# EAGLE design CrashButtonESP8266test (EAGLE 6.6.0)
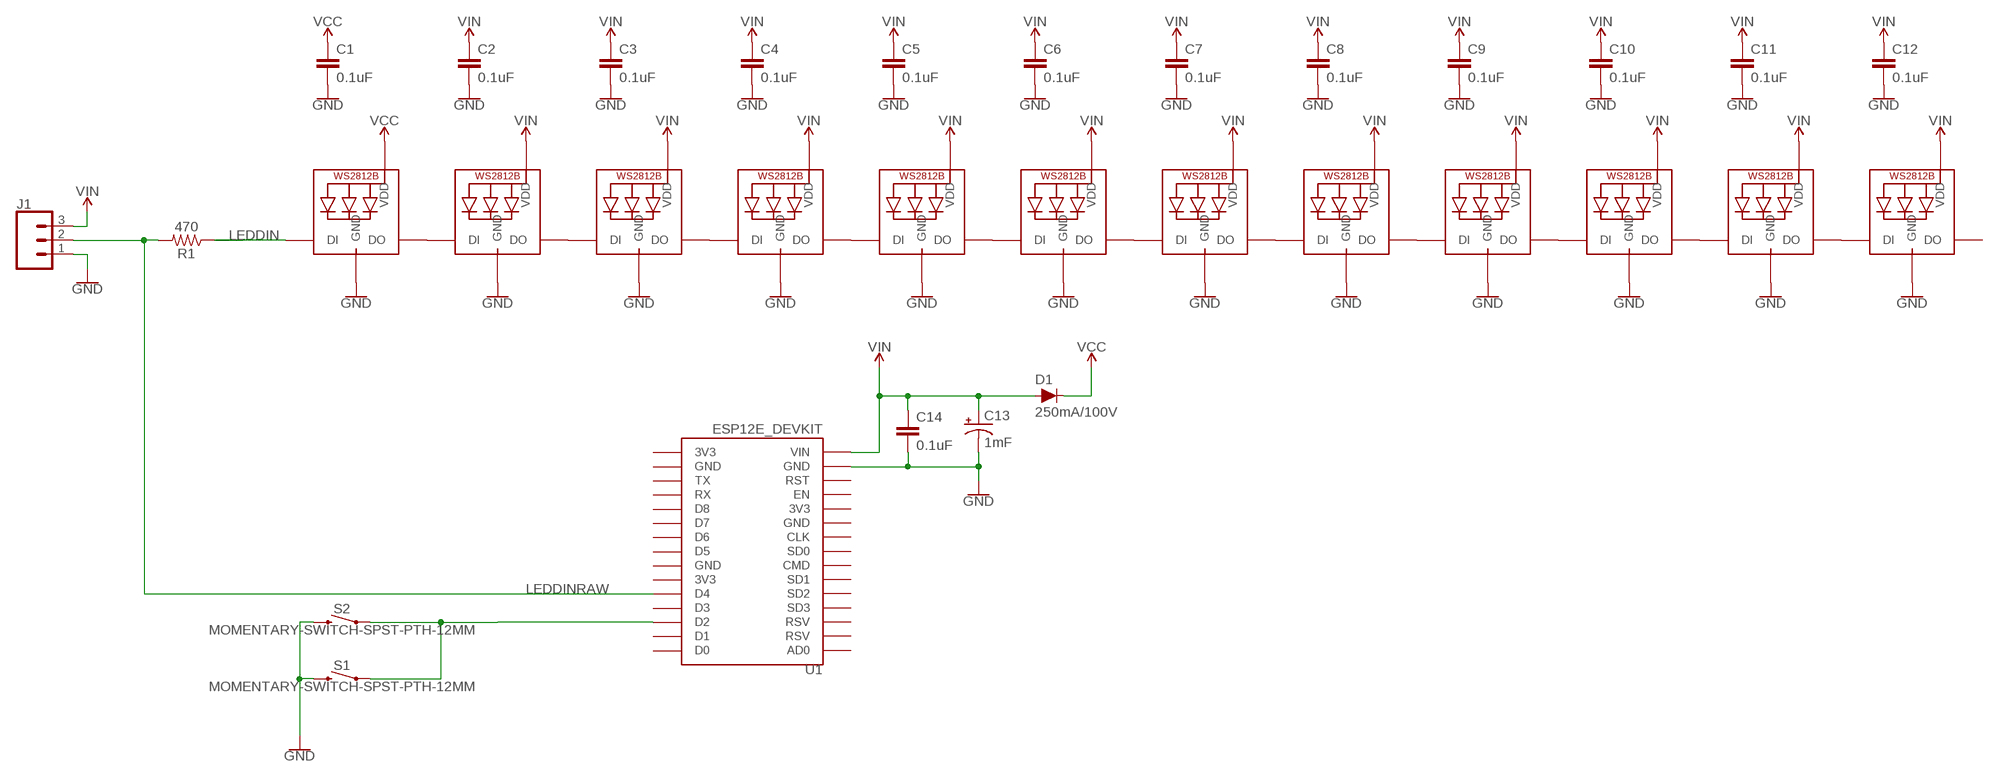
[diagram p0: schematic, sheet 1]

## Parts
C1  0.1uF  0.1UF-0603-25V-(+80/-20%)  [0603]
C2  0.1uF  0.1UF-0603-25V-(+80/-20%)  [0603]
C3  0.1uF  0.1UF-0603-25V-(+80/-20%)  [0603]
C4  0.1uF  0.1UF-0603-25V-(+80/-20%)  [0603]
C5  0.1uF  0.1UF-0603-25V-(+80/-20%)  [0603]
C6  0.1uF  0.1UF-0603-25V-(+80/-20%)  [0603]
C7  0.1uF  0.1UF-0603-25V-(+80/-20%)  [0603]
C8  0.1uF  0.1UF-0603-25V-(+80/-20%)  [0603]
C9  0.1uF  0.1UF-0603-25V-(+80/-20%)  [0603]
C10  0.1uF  0.1UF-0603-25V-(+80/-20%)  [0603]
C11  0.1uF  0.1UF-0603-25V-(+80/-20%)  [0603]
C12  0.1uF  0.1UF-0603-25V-(+80/-20%)  [0603]
C13  1mF  1000UF-RADIAL-5MM-25V-20%  [CPOL-RADIAL-5MM-10MM]
C14  0.1uF  0.1UF-0603-25V-(+80/-20%)  [0603]
D1  250mA/100V  DIODE-BAS16J  [SOD-323]
J1  CONN_03  [1X03]
LED1  WS2812B5050  [WS2812B]
LED2  WS2812B5050  [WS2812B]
LED3  WS2812B5050  [WS2812B]
LED4  WS2812B5050  [WS2812B]
LED5  WS2812B5050  [WS2812B]
LED6  WS2812B5050  [WS2812B]
LED7  WS2812B5050  [WS2812B]
LED8  WS2812B5050  [WS2812B]
LED9  WS2812B5050  [WS2812B]
LED10  WS2812B5050  [WS2812B]
LED11  WS2812B5050  [WS2812B]
LED12  WS2812B5050  [WS2812B]
R1  470  470OHM-0603-1/10W-1%  [0603]
S1  MOMENTARY-SWITCH-SPST-PTH-12MM  [TACTILE_SWITCH_PTH_12MM]
S2  MOMENTARY-SWITCH-SPST-PTH-12MM  [TACTILE_SWITCH_PTH_12MM]
U1  ESP12E_DEVKIT  [ESP12E_DEVKIT]

## Nets
GND: C1.2 C2.2 C3.2 C4.2 C5.2 C6.2 C7.2 C8.2 C9.2 C10.2 C11.2 C12.2 C13.- C14.2 J1.1 LED1.3-GND(GND) LED2.3-GND(GND) LED3.3-GND(GND) LED4.3-GND(GND) LED5.3-GND(GND) LED6.3-GND(GND) LED7.3-GND(GND) LED8.3-GND(GND) LED9.3-GND(GND) LED10.3-GND(GND) LED11.3-GND(GND) LED12.3-GND(GND) S1.3 S2.3 U1.GND@1(GND)
LEDDIN: LED1.4-DIN(DI) R1.1
LEDDINRAW: J1.2 R1.2 U1.D4
N$1: LED1.2-DOUT(DO) LED2.4-DIN(DI)
N$2: LED2.2-DOUT(DO) LED3.4-DIN(DI)
N$3: LED3.2-DOUT(DO) LED4.4-DIN(DI)
N$4: LED4.2-DOUT(DO) LED5.4-DIN(DI)
N$5: LED5.2-DOUT(DO) LED6.4-DIN(DI)
N$6: LED6.2-DOUT(DO) LED7.4-DIN(DI)
N$7: LED8.2-DOUT(DO) LED9.4-DIN(DI)
N$8: LED9.2-DOUT(DO) LED10.4-DIN(DI)
N$9: LED10.2-DOUT(DO) LED11.4-DIN(DI)
N$10: S1.1 S2.1 U1.D2
N$12: LED7.2-DOUT(DO) LED8.4-DIN(DI)
N$13: LED11.2-DOUT(DO) LED12.4-DIN(DI)
VCC: C1.1 D1.C LED1.1-VDD(VDD)
VIN: C2.1 C3.1 C4.1 C5.1 C6.1 C7.1 C8.1 C9.1 C10.1 C11.1 C12.1 C13.+ C14.1 D1.A J1.3 LED2.1-VDD(VDD) LED3.1-VDD(VDD) LED4.1-VDD(VDD) LED5.1-VDD(VDD) LED6.1-VDD(VDD) LED7.1-VDD(VDD) LED8.1-VDD(VDD) LED9.1-VDD(VDD) LED10.1-VDD(VDD) LED11.1-VDD(VDD) LED12.1-VDD(VDD) U1.VIN
Unconnected: LED12.2-DOUT(DO) U1.3V3@0(3V3) U1.3V3@1(3V3) U1.3V3@2(3V3) U1.AD0 U1.CLK U1.CMD U1.D0 U1.D1 U1.D3 U1.D5 U1.D6 U1.D7 U1.D8 U1.EN U1.GND@0(GND) U1.GND@2(GND) U1.GND@3(GND) U1.RST U1.RSV@0(RSV) U1.RSV@1(RSV) U1.RX U1.SD0 U1.SD1 U1.SD2 U1.SD3 U1.TX

## Library data of the parts
C1-C12 C14 = SparkFun-Capacitors:0.1UF: 0.1µF ceramic capacitors A capacitor is a passive two-terminal electrical component used to store electrical energy temporarily in an electric field.; PROD_ID: CAP-00810
C13 = SparkFun-Capacitors:1000UF: 1,000µF/1mF ceramic capacitors A capacitor is a passive two-terminal electrical component used to store electrical energy temporarily in an electric field. CAP-08070; PROD_ID: CAP-09538
D1 = SparkFun-DiscreteSemi:DIODE: Diode These are standard reverse protection diodes and small signal diodes. SparkFun Products: SparkFun SparkPunk Sound Kit <https://www.sparkfun.com/products/11177> SparkFun ESP8266 Thing <https://www.sparkfun.com/products/13231>; PROD_ID: DIO-09646
J1 = SparkFun-Connectors:CONN_03: Multi connection point. Often used as Generic Header-pin footprint for 0.1 inch spaced/style header connections On any of the 0.1 inch spaced packages, you can populate with these: Break Away Headers - Straight <https://www.sparkfun.com/products/116> (PRT-00116) Break Away Male Headers - Right Angle <https://www.sparkfun.com/products/553> (PRT-00553) Female Headers <https://www.sparkfun.com/products/115> (PRT-00115) Break Away Headers - Machine Pin <https://www.sparkfun.com/products/117> (PRT-00117) Break Away Female Headers - Swiss Machine Pin <https://www.sparkfun.com/products/743> (PRT-00743) Stackable Header - 3 Pin (Female, 0.1") <https://www.sparkfun.com/products/13875> (PRT-13875) For SCREWTERMINALS and SPRING TERMINALS visit here: Screw Terimnals on SparkFun.com <https://www.sparkfun.com/search/results?term=Screw+Terminals> (5mm/3.5mm/2.54mm spacing) This device is also useful as a general connection point to wire up your design to another part of your project. Our various solder wires solder well into these plated through hole pads. Hook-Up Wire - Assortment (Stranded, 22 AWG) <https://www.sparkfun.com/products/11375> (PRT-11375) Hook-Up Wire - Assortment (Solid Core, 22 AWG) <https://www.sparkfun.com/products/11367> (PRT-11367) View the entire wire category on our website here <https://www.sparkfun.com/categories/141> Special notes: Molex polarized connector foot print use with SKU : PRT-08232 with associated crimp pins and housings.
LED1-LED12 = adafruit:WS2812B
R1 = SparkFun-Resistors:470OHM: 470Ω resistor A resistor is a passive two-terminal electrical component that implements electrical resistance as a circuit element. Resistors act to reduce current flow, and, at the same time, act to lower voltage levels within circuits. - Wikipedia; PROD_ID: RES-07869
S1 S2 = SparkFun-Switches:MOMENTARY-SWITCH-SPST: Momentary Switch (Pushbutton) - SPST Normally-open (NO) SPST momentary switches (buttons, pushbuttons). Variants PTH-12MM - 12mm square, through-hole Momentary Pushbutton Switch - 12mm Square <https://www.sparkfun.com/products/9190> (COM-09190) PTH-6.0MM, PTH-6.0MM-KIT - 6.0mm square, through-hole Mini Pushbutton Switch <https://www.sparkfun.com/products/97> (COM-00097) KIT package intended for soldering kit's - only one side of pads' copper is exposed. PTH-RIGHT-ANGLE-KIT - Right-angle, through-hole Right Angle Tactile Button <https://www.sparkfun.com/products/10791> - Used on SparkFun BigTime Watch Kit <https://www.sparkfun.com/products/11734> SMD-12MM - 12mm square, surface-mount Tactile Button - SMD (12mm) <https://www.sparkfun.com/products/12993> (COM-12993) Used on SparkFun PicoBoard <https://www.sparkfun.com/products/11888> SMD-4.5MM - 4.5mm Square Trackball Switch Used on SparkFun Blackberry Trackballer Breakout <https://www.sparkfun.com/products/13169> SMD-4.6MMX2.8MM - 4.60mm x 2.80mm, surface mount Used on SparkFun SAMD21 Mini Breakout <https://www.sparkfun.com/products/13664> SMD-5.2MM, SMD-5.2-REDUNDANT - 5.2mm square, surface-mount Mini Pushbutton Switch - SMD <https://www.sparkfun.com/products/8720> (COM-08720) Used on Arduino Pro Mini <https://www.sparkfun.com/products/11114> REDUNDANT package connects both switch circuits together SMD-6.0X3.5MM - 6.0 x 3.5mm, surface mount Momentary Reset Switch SMD <https://www.sparkfun.com/products/8229> (COM-08229) SMD-6.2MM-TALL - 6.2mm square, surface mount Tactile Button - SMD (6mm) <https://www.sparkfun.com/products/12992> Used on SparkFun Digital Sandbox <https://www.sparkfun.com/products/12651> SMD-RIGHT-ANGLE - Right-angle, surface mount Used on SparkFun Block for Intel® Edison - Arduino <https://www.sparkfun.com/products/13036>; PROD_ID: SWCH-09185; SF_SKU: COM-09190
U1 = ESP12E_DEVKIT:ESP12E_DEVKIT: ESP12E DEVKIT BOARD

## Board
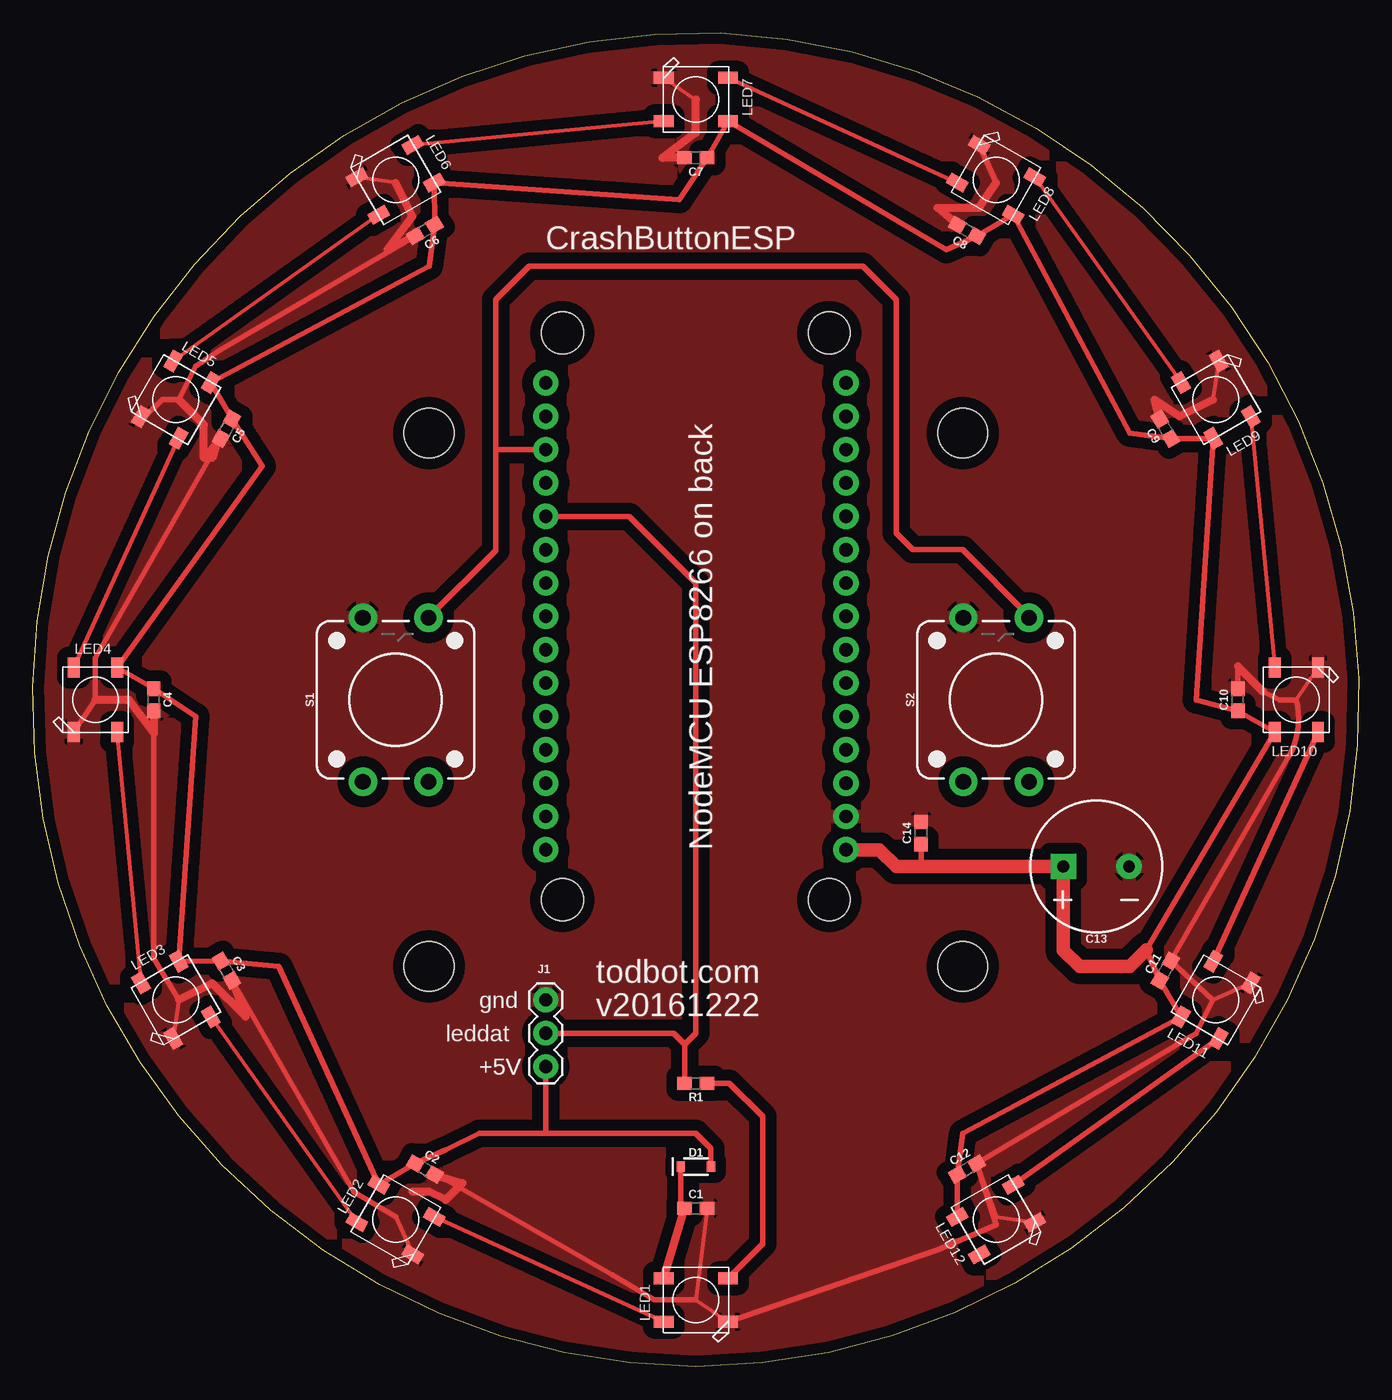
[diagram p1: board, top side]

Size 100.95 x 101.6 mm. Coordinates in mm from the lower left corner, seen from the top.
Outline: 50.49,0 arc-181 52.39,101.6 arc-177 50.49,0
Copper layers (1*16): Top 0.0356mm / dielectric 1.5011mm / Bottom 0.0356mm
Design rules "LaenPCBOrderTodTent": minimum track width 6mil, minimum drill 13mil, track to track 6mil, track to pad 6mil, pad to pad 6mil, via to via 6mil, smd to smd 6mil, copper to edge 15mil, drill to drill 6mil, minimum pad ring 7mil, minimum via ring 7mil, stop-mask expansion 3mil, vias tented up to drill 20mil, thermal gap 10mil
Holes 3.8 mm at 70.81,71.12 30.17,71.12 30.17,30.48 70.81,30.48

### Footprints (pad centres in the part's own frame; a part is rotated, then mirrored left to right if it is on the bottom)
0603 = smd 1.1 x 1: 1 -0.85,0; 2 0.85,0
CPOL-RADIAL-5MM-10MM = drill 0.9 pad 1.93 square: + 2.5,0 | drill 0.9 pad 1.93: - -2.5,0
SOD-323 = smd 0.63 x 0.83: A 1.15,0; C -1.15,0
1X03 = drill 1.016 pad 1.88: 1 0,0; 2 2.54,0; 3 5.08,0
WS2812B = smd 1.5 x 0.9: 1-VDD 2.45,-1.65; 2-DOUT 2.45,1.65; 3-GND -2.45,1.65; 4-DIN -2.45,-1.65
TACTILE_SWITCH_PTH_12MM = drill 1.2 pad 2.159: 1 6.25,-2.5; 2 -6.25,-2.5; 3 6.25,2.5; 4 -6.25,2.5
ESP12E_DEVKIT = drill 1.016 pad 1.93: 3V3@0 -11.43,-7.62; 3V3@1 11.43,5.08; 3V3@2 11.43,-17.78; AD0 -11.43,17.78; CLK -11.43,-2.54; CMD -11.43,2.54; D0 11.43,17.78; D1 11.43,15.24; D2 11.43,12.7; D3 11.43,10.16; D4 11.43,7.62; D5 11.43,0; D6 11.43,-2.54; D7 11.43,-5.08; D8 11.43,-7.62; EN -11.43,-10.16; GND@0 -11.43,-5.08; GND@1 -11.43,-15.24; GND@2 11.43,2.54; GND@3 11.43,-15.24; RST -11.43,-12.7; RSV@0 -11.43,15.24; RSV@1 -11.43,12.7; RX 11.43,-10.16; SD0 -11.43,0; SD1 -11.43,5.08; SD2 -11.43,7.62; SD3 -11.43,10.16; TX 11.43,-12.7; VIN -11.43,-17.78 | hole 3.2: -10.16,21.59; 10.16,21.59; 10.16,-21.59; -10.16,-21.59

### Placement (x,y rotation side)
C1  50.49,12.06 0 top
C2  29.85,15.05 330 top
C3  14.74,30.16 300 top
C4  9.21,50.8 270 top
C5  14.74,71.44 240 top
C6  29.85,86.55 210 top
C7  50.49,92.08 180 top
C8  71.12,86.55 150 top
C9  86.23,71.44 120 top
C10  91.76,50.8 90 top
C11  86.23,30.16 60 top
C12  71.12,15.05 30 top
C13  80.97,38.1 180 top
C14  67.63,40.64 90 top
D1  50.49,15.24 0 top
J1  39.06,27.94 270 top
LED1  50.49,5.08 180 top
LED2  27.63,11.21 150 top
LED3  10.89,27.94 120 top
LED4  4.77,50.8 90 top
LED5  10.89,73.66 60 top
LED6  27.63,90.39 30 top
LED7  50.49,96.52 0 top
LED8  73.35,90.39 330 top
LED9  90.08,73.66 300 top
LED10  96.21,50.8 270 top
LED11  90.08,27.94 240 top
LED12  73.35,11.21 210 top
R1  50.49,21.59 180 top
S1  27.63,50.8 90 top
S2  73.35,50.8 90 top
U1  50.49,57.15 0 bottom

### Tracks (layer width: path | path; a pad name or v marks a point on that pad's centre or on a via)
GND
  Top 0.152: 86.05,72.39 C9.2 86.05,72.39 | 86.05,72.39 85.73,72.31 86.05,72.39
  Top 0.305: 27.63,11.43 LED2.3-GND | 11.12,27.94 LED3.3-GND | 27.63,90.17 LED6.3-GND | LED7.3-GND 50.49,96.52 | LED9.3-GND 89.86,73.66 | 96.21,50.8 LED10.3-GND | C11.2 89.86,27.94 LED11.3-GND | C12.2 73.35,11.43 LED12.3-GND | C1.2 50.49,5.08 LED1.3-GND
  Top 0.406: 14.08,70.7 C5.2 4.77,53.98 4.77,50.8 LED4.3-GND | 8.58,72.39 9.85,73.66 11.12,73.66 12.39,76.2 14.29,77.47 C6.2 | LED8.3-GND 73.35,90.17 | 50.49,5.08 47.95,5.08 47.31,5.08 44.14,6.99 30.8,14.61 | C4.2 9.21,48.26 9.21,31.11 11.12,27.94 | C3.2 24.45,13.34 27.63,11.43 | LED1.3-GND 68.9,8.89 73.35,10.79 C12.2 88.59,25.4 89.86,27.94 C11.2 95.57,46.35 arc44 96.21,50.8 94.94,50.8 93.67,51.44 | C10.2 91.76,53.34
  Top 0.61: 91.76,53.34 93.67,51.44 | C9.2 85.41,73.66 87.32,72.39 89.86,73.66 | C8.2 68.9,88.27 72.08,88.27 73.35,90.17 | C7.2 47.95,92.08 50.49,93.98 50.49,96.52 | C6.2 26.99,85.09 28.9,87.63 27.63,90.17 | 14.08,70.7 13.66,69.22 | C5.2 13.02,69.22 13.02,71.75 11.12,73.66 | C4.2 9.21,48.26 7.31,50.8 4.77,50.8 | C3.2 16.2,26.67 13.66,29.21 11.12,27.94 | C2.2 32.71,13.97 31.44,12.7 30.17,13.34 28.9,13.34
  pour Top (isolate 0.838): -5.39,101.6 -5.39,-5.08 105.1,-5.08 105.1,102.87 -0.31,102.87
LEDDIN
  Top 0.406: 55.57,12.7 55.57,11.43 | 55.57,11.43 55.57,9.36 LED1.4-DIN | 55.57,12.7 55.57,11.43 | 55.57,12.7 55.57,13.97 55.57,19.05 53.03,21.59 R1.1
LEDDINRAW
  Top 0.406: 49.64,24.55 50.49,25.4 50.49,58.42 50.49,59.69 45.41,64.77 U1.D4 | 49.64,24.55 49.64,24.13 R1.2 | J1.2 47.95,25.4 | 47.95,25.4 48.37,25.4 | 49.64,24.55 48.79,25.4 47.95,25.4
N$1
  Top 0.305: LED1.2-DOUT LED2.4-DIN
N$2
  Top 0.305: LED3.4-DIN LED2.2-DOUT
N$3
  Top 0.305: LED3.2-DOUT LED4.4-DIN
N$4
  Top 0.305: LED4.2-DOUT LED5.4-DIN
N$5
  Top 0.305: LED6.4-DIN LED5.2-DOUT
N$6
  Top 0.305: LED7.4-DIN LED6.2-DOUT
N$7
  Top 0.305: LED8.2-DOUT LED9.4-DIN
N$8
  Top 0.305: LED9.2-DOUT LED10.4-DIN
N$9
  Top 0.406: LED11.4-DIN LED10.2-DOUT
N$10
  Top 0.406: 35.25,69.85 35.25,81.28 37.79,83.82 42.87,83.82 50.49,83.82 63.19,83.82 65.73,81.28 65.73,63.5 67,62.23 70.81,62.23 75.85,57.19 S2.1 | 35.25,69.85 35.25,62.17 S1.1 | U1.D2 35.25,69.85
N$12
  Top 0.305: LED7.2-DOUT LED8.4-DIN
N$13
  Top 0.406: LED12.4-DIN LED11.2-DOUT
VCC
  Top 0.406: D1.C 49.34,12.06 C1.1
  Top 0.61: LED1.1-VDD C1.1
VIN
  Top 0.406: LED9.1-VDD | LED9.1-VDD C9.1 83.51,71.12 LED8.1-VDD C8.1 69.54,85.09 LED7.1-VDD C7.1 49.22,88.9 LED6.1-VDD C6.1 30.17,83.82 LED5.1-VDD C5.1 17.47,68.58 LED4.1-VDD C4.1 12.39,49.53 LED3.1-VDD C3.1 18.74,30.48 LED2.1-VDD C2.1 31.44,16.51 33.98,17.78 39.06,17.78 | LED9.1-VDD 88.59,50.8 C10.1 LED10.1-VDD 84.78,31.75 C11.1 LED11.1-VDD 70.81,17.78 C12.1 LED12.1-VDD | 39.06,17.78 50.49,17.78 51.64,16.63 D1.A | C14.1 67.63,38.1 68.27,38.1 | J1.3 39.06,17.78
  Top 1.016: U1.VIN 64.46,39.37 65.73,38.1 68.27,38.1 C13.+ 78.47,31.71 79.7,30.48 83.51,30.48 84.78,31.75

### Text on the board
tNames: CrashButtonESP | NodeMCU ESP8266 on back | todbot.com | gnd | v20161222 | leddat | +5V | +5V